# Altium schematic sheet MelansonTech Isolated Shunt Amplifier.SchDoc
size C
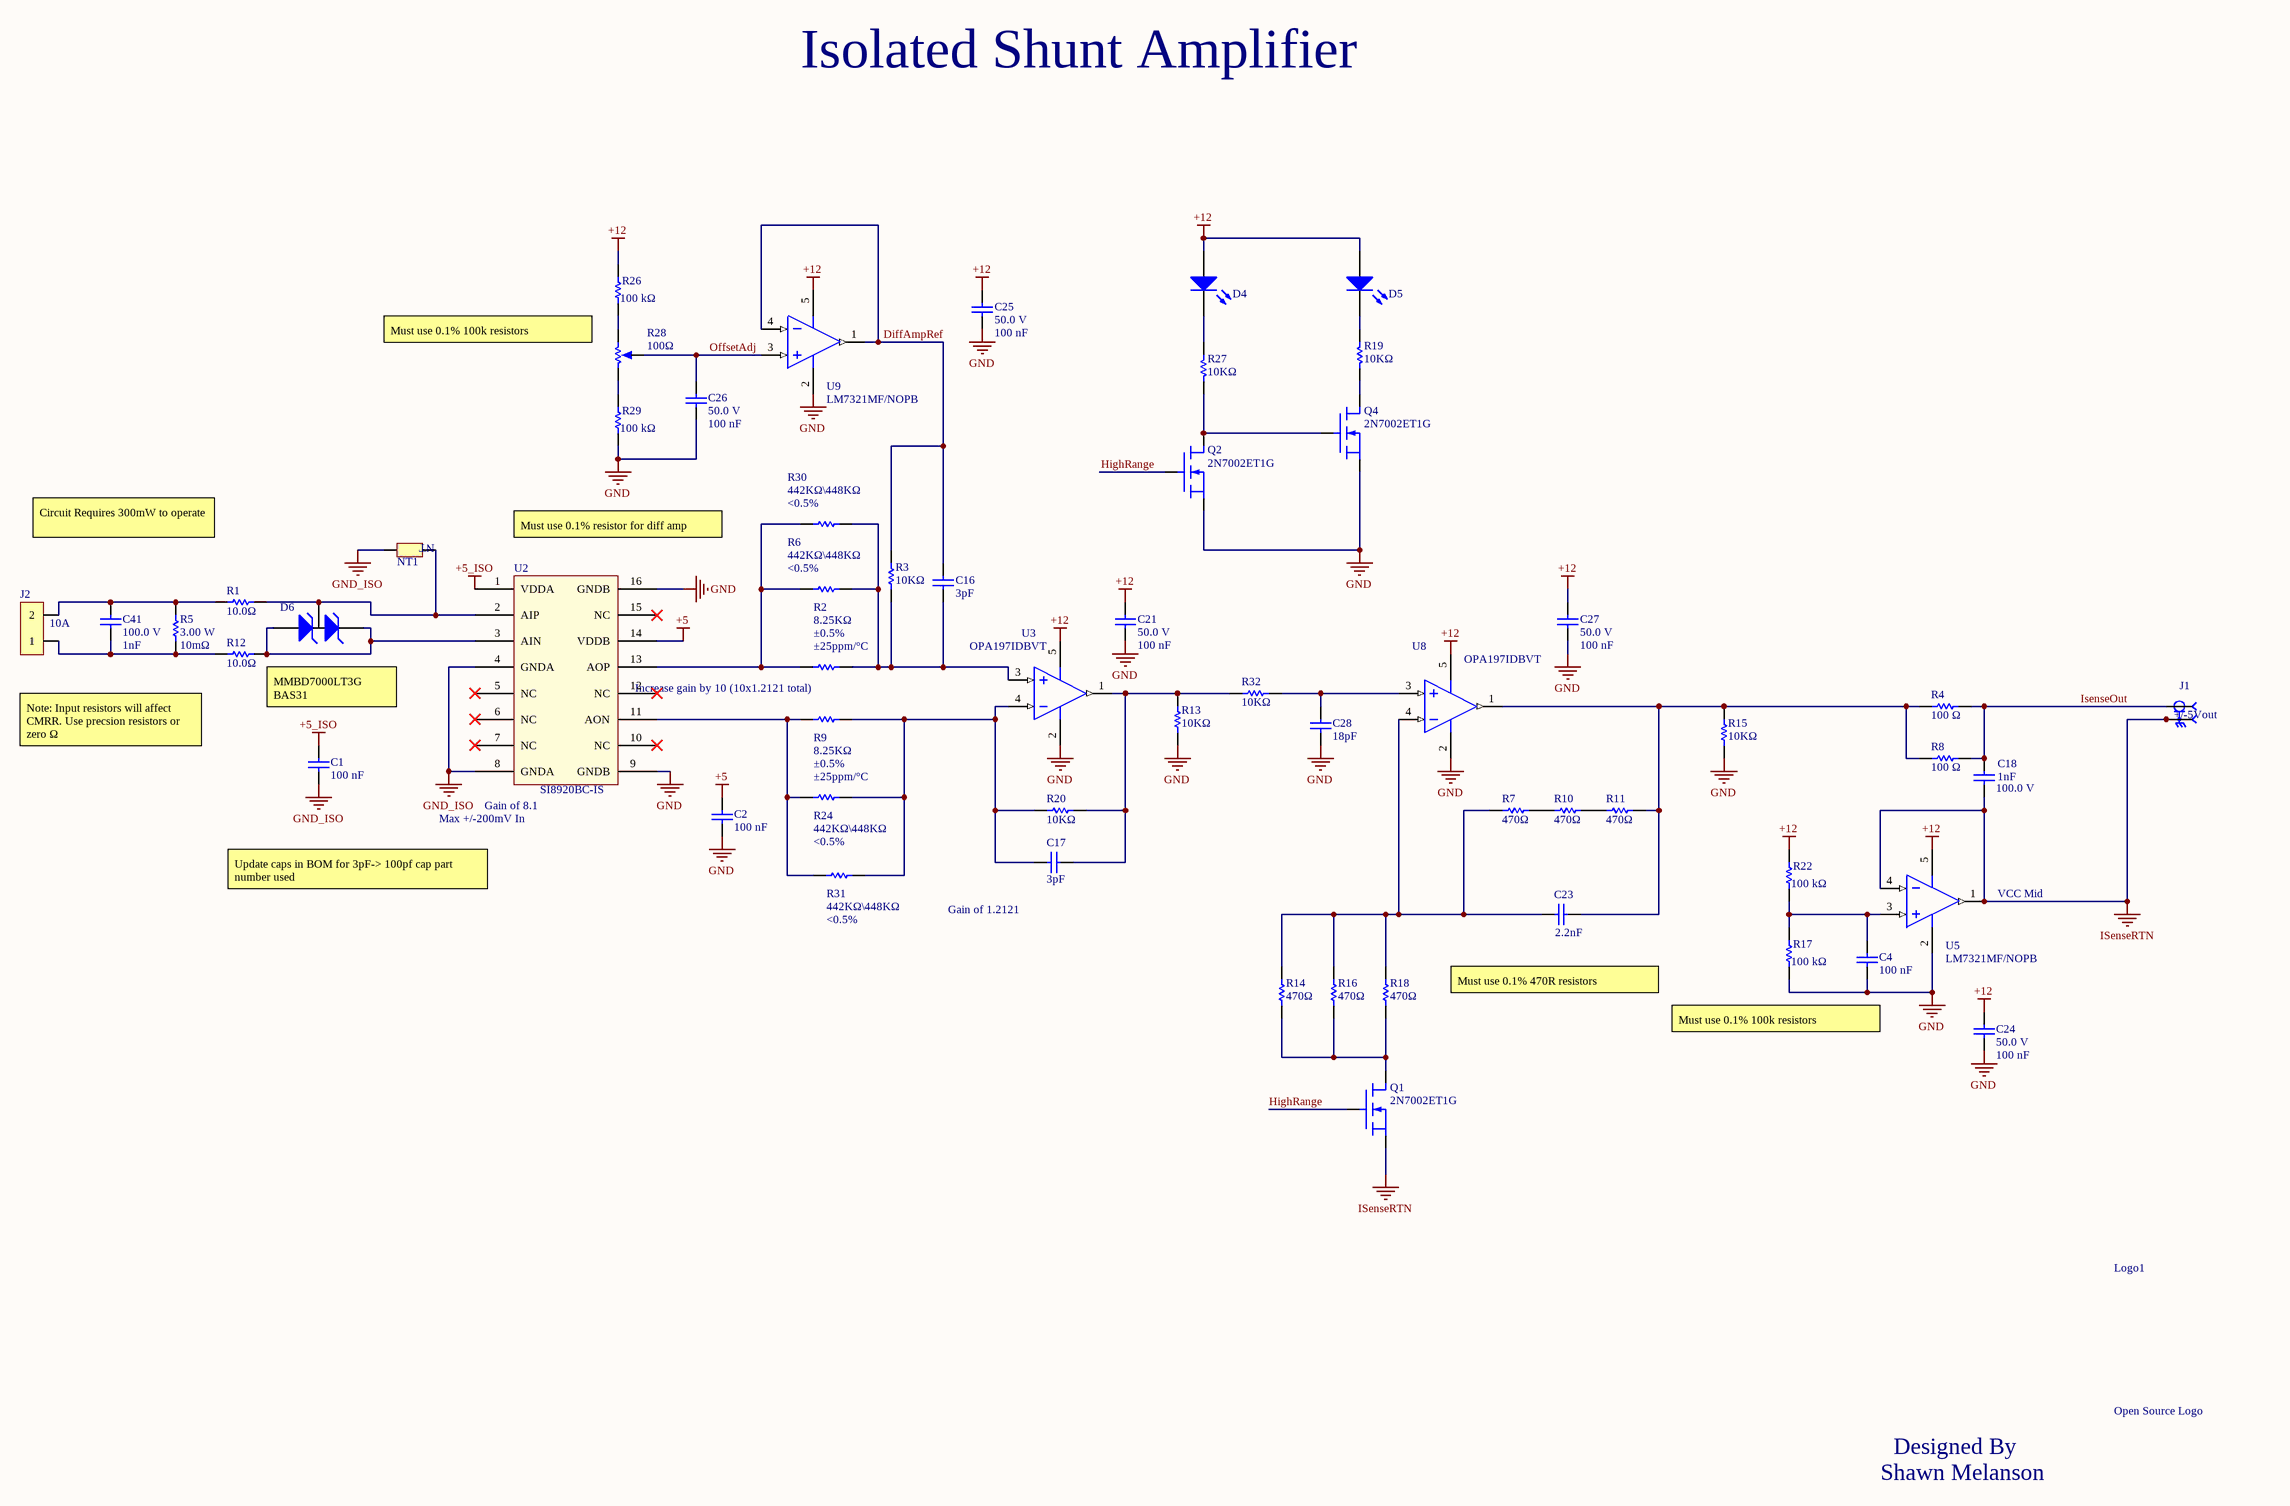
[diagram p0: MelansonTech Isolated Shunt Amplifier.SchDoc]

## Parts
C1  Capacitance: 100 nF  [CAP, 0805, HD]  (hidden comment: 08055C104JAT2A)
C2  Capacitance: 100 nF  [CAP, 0805, HD]  (hidden comment: 08055C104JAT2A)
C4  Capacitance: 100 nF  [CAP, 0805, HD]  (hidden comment: 08055C104JAT2A)
C16  Capacitance: 3pF  [CAP, 0805, HD]  (hidden comment: GRM21A5C2E101JW01D)
C17  Capacitance: 3pF  [CAP, 0805, HD]  (hidden comment: GRM21A5C2E101JW01D)
C18  Voltage Rating (DC): 100.0 V  Capacitance: 1nF  [CAP, 0805, HD]  (hidden comment: C0805X102J1GACAUTO)
C21  Voltage Rating (DC): 50.0 V  Capacitance: 100 nF  [CAP, 0805, HD]  (hidden comment: 08055C104JAT2A)
C23  Cap: 2.2nF  [CAP, 0805, HD]  (hidden comment: Cap)
C24  Voltage Rating (DC): 50.0 V  Capacitance: 100 nF  [CAP, 0805, HD]  (hidden comment: 08055C104JAT2A)
C25  Voltage Rating (DC): 50.0 V  Capacitance: 100 nF  [CAP, 0805, HD]  (hidden comment: 08055C104JAT2A)
C26  Voltage Rating (DC): 50.0 V  Capacitance: 100 nF  [CAP, 0805, HD]  (hidden comment: 08055C104JAT2A)
C27  Voltage Rating (DC): 50.0 V  Capacitance: 100 nF  [CAP, 0805, HD]  (hidden comment: 08055C104JAT2A)
C28  Capacitance: 18pF  [CAP, 0805, HD]  (hidden comment: GRM21A5C2E101JW01D)
C41  Voltage Rating (DC): 100.0 V  Capacitance: 1nF  [CAP, 0805, HD]  (hidden comment: C0805X102J1GACAUTO)
D4  OVLBB4C7  [LED,TH,T1,3MM-Vert]  (value not drawn)
D5  OVLBB4C7  [LED,TH,T1,3MM-Vert]  (value not drawn)
D6  BAT54SLT1G  [SOT23-3]  (value not drawn)
J1  142-0701-801  [CINCH_142-0701-801]  (value not drawn)
J2  TE Connectivity 282836-2  [TERM BLOCK 2POS SIDE ENTRY 5MM]  (value not drawn)
Logo1  Open Source Logo  [Symbol,Open Source - No Text]
NT1  Net Tie,0.254mm  [0.254mm Net Tie]  (value not drawn)  (net tie, no BOM)
Q1  2N7002ET1G  [SOT23-3]
Q2  2N7002ET1G  [SOT23-3]
Q4  2N7002ET1G  [SOT23-3]
R1  Resistance: 10.0Ω  [res, 0805, HD]  (hidden comment: Vishay CRCW08051K00JNEA)
R2  Tolerance: ±0.5%  Temperature Coefficient: ±25ppm/°C  Resistance: 8.25KΩ  [res, 0805, HD]  (hidden comment: RR1220P-8251-D-M)
R3  Resistance: 10KΩ  [res, 0805, HD]  (hidden comment: Vishay / Dale CRCW080510K0FKTA)
R4  Resistance: 100 Ω  [res, 0805, HD]  (hidden comment: CRCW0805100RJNEAC)
R5  Power Rating: 3.00 W  Resistance: 10mΩ  [Res 2512]  (hidden comment: Res1)
R6  Resistance: 442KΩ\448KΩ  Tolerance: <0.5%  [res, 0805, HD]
R7  Resistance: 470Ω  [res, 0805, HD]  (hidden comment: CR0805-JW-471ELF)
R8  Resistance: 100 Ω  [res, 0805, HD]  (hidden comment: CRCW0805100RJNEAC)
R9  Tolerance: ±0.5%  Temperature Coefficient: ±25ppm/°C  Resistance: 8.25KΩ  [res, 0805, HD]  (hidden comment: RR1220P-8251-D-M)
R10  Resistance: 470Ω  [res, 0805, HD]  (hidden comment: CR0805-JW-471ELF)
R11  Resistance: 470Ω  [res, 0805, HD]  (hidden comment: CR0805-JW-471ELF)
R12  Resistance: 10.0Ω  [res, 0805, HD]  (hidden comment: Vishay / Dale CRCW080510K0FKTA)
R13  Resistance: 10KΩ  [res, 0805, HD]  (hidden comment: Vishay / Dale CRCW080510K0FKTA)
R14  Resistance: 470Ω  [res, 0805, HD]  (hidden comment: CR0805-JW-471ELF)
R15  Resistance: 10KΩ  [res, 0805, HD]  (hidden comment: Vishay / Dale CRCW080510K0FKTA)
R16  Resistance: 470Ω  [res, 0805, HD]  (hidden comment: CR0805-JW-471ELF)
R17  Resistance: 100 kΩ  [res, 0805, HD]  (hidden comment: CRCW0805100KFKEA)
R18  Resistance: 470Ω  [res, 0805, HD]  (hidden comment: CR0805-JW-471ELF)
R19  Resistance: 10KΩ  [res, 0805, HD]  (hidden comment: Vishay / Dale CRCW080510K0FKTA)
R20  Resistance: 10KΩ  [res, 0805, HD]  (hidden comment: Vishay / Dale CRCW080510K0FKTA)
R22  Resistance: 100 kΩ  [res, 0805, HD]  (hidden comment: CRCW0805100KFKEA)
R24  Resistance: 442KΩ\448KΩ  Tolerance: <0.5%  [res, 0805, HD]
R26  Resistance: 100 kΩ  [res, 0805, HD]  (hidden comment: CRCW0805100KFKEA)
R27  Resistance: 10KΩ  [res, 0805, HD]  (hidden comment: Vishay / Dale CRCW080510K0FKTA)
R28  Resistance: 100Ω  [Res,SMD,POT,TC33 Series]  (hidden comment: TC33X-2-101E)
R29  Resistance: 100 kΩ  [res, 0805, HD]  (hidden comment: CRCW0805100KFKEA)
R30  Resistance: 442KΩ\448KΩ  Tolerance: <0.5%  [res, 0805, HD]
R31  Resistance: 442KΩ\448KΩ  Tolerance: <0.5%  [res, 0805, HD]
R32  Resistance: 10KΩ  [res, 0805, HD]  (hidden comment: Vishay / Dale CRCW080510K0FKTA)
U2  SI8920BC-IS  [SOIC-16 - Wide]
U3  OPA197IDBVT  [SOT23-5]
U5  LM7321MF/NOPB  [SOT23-5]
U8  OPA197IDBVT  [SOT23-5]
U9  LM7321MF/NOPB  [SOT23-5]

## Nets
+5: C2.2 U2.14(VDDB)
+5_ISO: C1.2 U2.1(VDDA)
+12: C21.2 C24.2 C25.2 C27.2 D4.1(A) D5.1(A) R22.2 R26.2 U3.5(V+) U5.5(V+) U8.5(V+) U9.5(V+)
GND: C2.1 C4.1 C21.1 C24.1 C25.1 C26.1 C27.1 C28.2 Q2.2(S) Q4.2(S) R13.2 R15.1 R17.1 R29.1 U2.9(GNDB) U2.16(GNDB) U3.2(V-) U5.2(V-) U8.2(V-) U9.2(V-)
GND_ISO: C1.1 NT1.2 U2.4(GNDA) U2.8(GNDA)
ISenseRTN: C18.1 J1.S1 J1.S2 J1.S3 J1.S4 Q1.2(S) U5.1(OUT) U5.4(IN-)
DiffAmpRef: C16.1 R3.1 U9.1(OUT) U9.4(IN-)
HighRange: Q1.1(G) Q2.1(G)
IsenseOut: C18.2 J1.1 R4.1 R8.1
OffsetAdj: C26.2 R28.2 U9.3(IN+)
NetC4_2: C4.2 R17.2 R22.1 U5.3(IN+)
NetC16_2: C16.2 R2.1 R3.2 R6.1 R30.1 U3.3(1IN+)
NetC17_1: C17.1 R13.1 R20.1 R32.1 U3.1(1OUT)
NetC17_2: C17.2 R9.1 R20.2 R24.1 R31.1 U3.4(1IN-)
NetC23_1: C23.1 R4.2 R8.2 R11.1 R15.2 U8.1(1OUT)
NetC23_2: C23.2 R7.2 R14.1 R16.1 R18.1 U8.4(1IN-)
NetC28_1: C28.1 R32.2 U8.3(1IN+)
NetC41_1: C41.1 J2.1 R5.2 R12.2
NetC41_2: C41.2 J2.2 R1.2 R5.1
NetD4_2: D4.2(K) R27.1
NetD5_2: D5.2(K) R19.1
NetD6_1: D6.1(A) D6.2(K) R12.1 U2.3(AIN)
NetD6_3: D6.3(AK) NT1.1 R1.1 U2.2(AIP)
NetQ1_3: Q1.3(D) R14.2 R16.2 R18.2
NetQ2_3: Q2.3(D) Q4.1(G) R27.2
NetQ4_3: Q4.3(D) R19.2
NetR2_2: R2.2 R6.2 R30.2 U2.13(AOP)
NetR7_1: R7.1 R10.2
NetR9_2: R9.2 R24.2 R31.2 U2.11(AON)
NetR10_1: R10.1 R11.2
NetR26_1: R26.1 R28.3
NetR28_1: R28.1 R29.2

Not connected (* = marked no-connect by the designer): U2 5(NC)* 6(NC)* 7(NC)* 10(NC)* 12(NC)* 15(NC)*

## Notes on the sheet
- Isolated Shunt Amplifier
- Must use 0.1% 100k resistors
- Circuit Requires 300mW to operate
- Must use 0.1% resistor for diff amp
- 10A
- (near R12) MMBD7000LT3G
  BAS31
- (near U3) Increase gain by 10 (10x1.2121 total)
- (near J1) +/-5Vout
- Note: Input resistors will affect CMRR. Use precsion resistors or zero Ω
- (near U2) Max +/-200mV In
- (near U2) Gain of 8.1
- Update caps in BOM for 3pF-> 100pf cap part number used
- (near C17) Gain of 1.2121
- (near U5) VCC Mid
- Must use 0.1% 470R resistors
- Shawn Melanson
- Designed By
- (in symbol Net Tie,0.254mm) NT

## Library data of the parts
C1 C2 C4 = Cap,0805,100nf,50V,5%,08055C104JAT2A: Capacitor; Ceramic; Cap 0.1 uF; Tol 5%; Vol-Rtg 50 VDC; SMT; 0805; X7R; Tape & Reel; Lead-Free Status: Lead Free; Voltage Rating (DC): 50.0 V; Case/Package (SI): 2012; Insulation Resistance: 100 GΩ; Detailed Description: 0.1µF ±5% 50V Ceramic Capacitor X7R 0805 (2012 Metric); Mounting Style: Surface Mount; Packaging: Tape & Reel (TR), Cut Tape (CT); RoHS: Compliant; Size-Width: 1.24 mm; Case/Package: 0805; Number of Pins: 2; digikey url: http://www.digikey.ca/product-detail/en/avx-corporation/08055C104JAT2A/478-3352-1-ND/930144; REACH SVHC Compliance: No SVHC; Dielectric Characteristic: X7R; Capacitance Tolerance: ±5%; Size-Length: 2.01 mm; Size-Height: 710 µm; Size-Thickness: 940 µm; Manufacturer Part Number: 08055C104JAT2A; Octopart URL: http://octopart.com/08055c104jat2a-avx-55388010; Operating Temperature: -55°C ~ 125°C
C16 C17 C23 C28 = CAP,0805,Generic
C18 C41 = Cap,0805,1nF,±5%,100Vdc,CL10F104ZB8NNNC: CAPACITOR, 1NF, 100V, NP0, 0805; Capacitance Tolerance: ±5%; Dielectric Characteristic: C0G/NP0; Dielectric Material: Ceramic; Lead-Free Status: Lead Free; Case/Package: 0805; Mounting Style: Surface Mount; Octopart Url: https://octopart.com/c0805x102j1gacauto-kemet-23280135; Packaging: Cut Tape (CT); REACH SVHC Compliance: No SVHC; RoHS: Compliant; mfg P/N: C0805X102J1GACAUTO; Supplier 1: Digi-Key; Supplier Part Number 1: 399-19430-1-ND
C21 C24-C27 = Cap,0805,100nf,50V,5%,08055C104JAT2A: Capacitor; Ceramic; Cap 0.1 uF; Tol 5%; Vol-Rtg 50 VDC; SMT; 0805; X7R; Tape & Reel; Lead-Free Status: Lead Free; Case/Package (SI): 2012; Insulation Resistance: 100 GΩ; Detailed Description: 0.1µF ±5% 50V Ceramic Capacitor X7R 0805 (2012 Metric); Mounting Style: Surface Mount; Packaging: Tape & Reel (TR), Cut Tape (CT); RoHS: Compliant; Size-Width: 1.24 mm; Case/Package: 0805; Number of Pins: 2; digikey url: http://www.digikey.ca/product-detail/en/avx-corporation/08055C104JAT2A/478-3352-1-ND/930144; REACH SVHC Compliance: No SVHC; Dielectric Characteristic: X7R; Capacitance Tolerance: ±5%; Size-Length: 2.01 mm; Size-Height: 710 µm; Size-Thickness: 940 µm; Manufacturer Part Number: 08055C104JAT2A; Octopart URL: http://octopart.com/08055c104jat2a-avx-55388010; Operating Temperature: -55°C ~ 125°C; Supplier 1: Digi-Key; Supplier Part Number 1: 478-3352-1-ND
D4 D5 = LED,TH,T1,3mm,Blue,OVLBB4C7: Blue 470nm LED Indication - Discrete 3.2V Radial; Mfg: TT Electronics/Optek Technology; Product Status: Active; Configuration: Standard; Lens Color: Colorless; Lens Transparency: Clear; Millicandela Rating: 1800mcd; Lens Style: Round with Domed Top; Lens Size: 3mm, T-1; Current - Test: 20mA; Viewing Angle: 45°; Base Product Number: OVLBB4; Category: Optoelectronics  LED Indication - Discrete; Color: Blue; Voltage - Forward (Vf) (Typ): 3.2V; Mounting Type: Through Hole; Wavelength - Dominant: 470nm; Package / Case: Radial; Supplier Device Package: 3mm; Height (Max): 5.35mm
D6 = Diode,Shottky,Array,Series,30V,200mA,BAT54SLT1G: Diode Array 1 Pair Series Connection Schottky 30V 200mA (DC) Surface Mount TO-236-3, SC-59, SOT-23-3; Manufacturer: ON Semiconductor; Voltage - Forward (Vf) (Max) @ If: 800mV @ 100mA; Speed: Small Signal =< 200mA (Io), Any Speed; Reverse Recovery Time (trr): 5ns; Current - Reverse Leakage @ Vr: 2µA @ 25V; Detailed Description: Diode Array 1 Pair Series Connection Schottky 30V 200mA (DC) Surface Mount TO-236-3, SC-59, SOT-23-3; mfg P/N: BAT54SLT1G; Diode Type: Schottky; Diode Configuration: 1 Pair Series Connection; Voltage - DC Reverse (Vr) (Max): 30V; Current - Average Rectified (Io) (per Diode): 200mA (DC); Operating Temperature - Junction: 125°C (Max); Mounting Type: Surface Mount; Package / Case: TO-236-3, SC-59, SOT-23-3; Supplier Device Package: SOT-23-3 (TO-236); Base Part Number: BAT54SL; Supplier 1: Digi-Key; Supplier Part Number 1: BAT54SLT1GOSCT-ND; Supplier 2: LCSC; Supplier Part Number 2: C19726
J1 = Conn,SMA,Female,End Launch,142-0701-801: CONN SMA JACK STR 50OHM EDGE MNT; Manufacturer: Cinch Connectivity Solutions Johnson; Detailed Description: SMA Connector Jack, Female Socket 50Ohm Board Edge, End Launch Solder; Connector: Style   SMA; Connector Type: Jack, Female Socket; Contact Termination: Solder; Body Material: Brass; Body Finish: Gold; Dielectric Material: Polytetrafluoroethylene (PTFE); Center Contact Material: Beryllium Copper; Mating Cycles: 500; Number of Ports: 1; Frequency - Max: 18GHz; Voltage Rating: 335V; mfg P/N: 142-0701-801; Category: Connectors, Interconnects  Coaxial Connectors (RF); Part Status: Active; Shield Termination: Solder; Impedance: 50Ohm; Mounting Type: Board Edge, End Launch; Fastening Type: Threaded; Housing Color: Gold; Center Contact Plating: Gold; Operating Temperature: -65°C ~ 165°C; Supplier 1: Digi-Key; Supplier Part Number 1: J502-ND
J2 = TERM BLOCK 2POS SIDE ENTRY 5MM, 282836-2: Wire to Board 2 Position 5 mm Pitch 30-16 AWG Euro Style Terminal Block; Voltage Rating (AC): 250.0 V; ELV Compliant: Compliant; Current Rating: 13.5 A; Number of Contacts: 2; Pin Pitch: 0.005 m; Lead-Free Status: Lead Free; Wire Gauge: 15.0 AWG; RoHS: Compliant; Contact Material: Brass; Contact Plating: Tin; Color: Green; Manufacturer Part Number: 282836-2; Flammability Rating: UL 94 V-0; Mounting Style: PCB; Housing Material: Nylon 6/6; Insulation Material: Nylon; Housing Color: Green; Orientation: Right Angle; Lifecycle Status: Active; REACH SVHC Compliance: No SVHC; Number of Positions: 2; Supplier 1: TME; Supplier 2: Newark; Supplier 3: Digi-Key; Supplier 4: Digi-Key; Supplier Part Number 4: A98076-ND
Logo1 = Symbol,Open Source: Open Source Silk Screen Logo
Q1 Q2 Q4 = MOSFET,N-Channel,SOT23,0.25A,60V,2N7002ET1G: Small Signal MOSFET, 60 V, 310 mA, Single, N-Channel, 3-Pin SOT-23, Pb-Free, Tape and Reel; Manufacturer: ON Semiconductor; Continuous Drain Current (Ids): 0.25A; Lead-Free Status: Lead Free; Drain to Source Voltage (Vds): 60.0 V; Power Dissipation (Max): 350mW (Ta); REACH SVHC Compliance: No SVHC; Number of Pins: 3; Halogen Free Status: Halogen Free; Case/Package: SOT-23-3; Polarity: N-Channel; RoHS: Compliant; Lifecycle Status: Active; Supplier 1: Digi-Key; Supplier Part Number 1: 2N7002ET1GOSCT-ND; Supplier 2: LCSC; Supplier Part Number 2: C71533; Manufacturer Part Number: 2N7002ET1G
R1 R12 = Res,0805,10.0Ω,5%,±200ppm/°C,RMCF0805JT10R0: RES 10 OHM 5% 1/8W 0805; Manufacturer: Stackpole Electronics Inc; Detailed Description: 10 Ohms ±5% 0.125W, 1/8W Chip Resistor 0805 (2012 Metric) Automotive AEC-Q200 Thick Film; Categories: Resistors   Chip Resistor - Surface Mount; Power (Watts): 0.125W, 1/8W; mfg P/N: RMCF0805JT10R0; Part Status: Active; Series: RMCF; Tolerance: ±5%; Composition: Thick Film; Features: Automotive AEC-Q200; Temperature Coefficient: ±200ppm/°C; Operating Temperature: -55°C ~ 155°C; Package / Case: 0805 (2012 Metric); Ratings: AEC-Q200; Supplier Device Package: 0805; Supplier 1: Digi-Key; Supplier Part Number 1: RMCF0805JT10R0CT-ND
R2 R9 = Res,0805,8.25KΩ,0.5%,±25ppm/°C,RR1220P-8251-D-M: RES SMD 8.25KOHM 0.5% 1/10W 0805; Manufacturer: Susumu; Detailed Description: 8.25 kOhms ±0.5% 0.1W, 1/10W Chip Resistor 0805 (2012 Metric) Thin Film; Power (Watts): 0.1W, 1/10W; mfg P/N: RR1220P-8251-D-M; Category: Resistors  Chip Resistor - Surface Mount; Mfr: Susumu; Series: RR; Part Status: Active; Composition: Thin Film; Operating Temperature: -55°C ~ 125°C; Package / Case: 0805 (2012 Metric); Size / Dimension: 0.079"" L x 0.049"" W (2.00mm x 1.25mm); Height - Seated (Max): 0.020"" (0.50mm); Number of Terminations: 2
R3 R13 R15 R19 R20 R27 R32 = Res,0805,10.0kΩ,1%,100 ppm,CRCW080510K0FKTA: RES SMD 10K OHM 1% 1/8W 0805; Temperature Coefficient: 100.0 ppm/C; Lead-Free Status: Contains Lead; Voltage Rating (DC): 150.0 V; Power Rating: 0.125 W; Case/Package (SI): 2012; Size-Width: 0.00125 m; Resistance Tolerance: 1%; Size-Length: 0.002 m; RoHS: Non-Compliant; Power Dissipation: 0.125 W; Number of Pins: 2; REACH SVHC Compliance: No SVHC; Size-Height: 0.00045 m; Case/Package: 0805; Mounting Style: Surface Mount; Supplier 1: Digi-Key; Supplier Part Number 1: 541-3016-1-ND
R4 R8 = Res,0805,100Ω,5%,±200ppm/°C: RES 100 OHM 5% 1/8W 0805; Lead-Free Status: Lead Free; Power Rating: 0.125 W; Detailed Description: 100 Ohms ±5% 0.125W, 1/8W Chip Resistor 0805 (2012 Metric) Thick Film; Case/Package: 0805 (2012 Metric); Number of Pins: 2; RoHS: Compliant; mfg P/N: CRCW0805100RJNEAC; Tolerance: ±5%; Temperature Coefficient: ±200ppm/°C; Operating Temperature: -55°C ~ 155°C; Supplier 1: Digi-Key; Supplier Part Number 1: 541-100ACT-ND
R5 = Res,2512,10mΩ,3.00W,±1%,CRA2512-FZ-R010ELF: Resistor; Metal Film; Res 0.01 Ohms; Pwr-Rtg 3 W; Tol 1%; SMT; 2512; Current Sense; Case/Package (SI): 2512; Resistance Tolerance: ±1%; Octopart URL: http://octopart.com/cra2512-fz-r010elf-bourns-7483589; Manufacturer Part Number: CRA2512-FZ-R010ELF; Packaging: Tape & Reel (TR), Cut Tape (CT); REACH SVHC Compliance: No SVHC; RoHS: Compliant; Number of Pins: 2; Mounting Style: Surface Mount; Case/Package: 1005
R6 R24 R30 R31 = Res,0805,Generic: PPM: *; Wattage: *
R7 R10 R11 R14 R16 R18 = res,0805,470Ω,5%,200ppm,CR0805-JW-471ELF: RES SMD 470 OHM 5% 1/8W 0805; Manufacturer: Bourns Inc.; Detailed Description: 470 Ohms ±5% 0.125W, 1/8W Chip Resistor 0805 (2012 Metric) Moisture Resistant Thick Film; Categories: Resistors   Chip Resistor - Surface Mount; Power (Watts): 0.125W, 1/8W; Temperature Coefficient: ±200ppm/°C; mfg P/N: CR0805-JW-471ELF; Part Status: Active; Tolerance: ±5%; Composition: Thick Film; Features: Moisture Resistant; Operating Temperature: -55°C ~ 155°C; Package / Case: 0805 (2012 Metric); Supplier Device Package: 0805; Size / Dimension: 0.079" L x 0.049" W (2.00mm x 1.25mm); Height - Seated (Max): 0.024" (0.60mm); Number of Terminations: 2; Base Part Number: CR0805; Supplier 1: Digi-Key; Supplier Part Number 1: 118-CR0805-JW-471ELFCT-ND
R17 R22 R26 R29 = Res,0805,100kΩ,1%,100ppm,CRCW0805100KFKEA: 100 kOhms ±1% 0.125W, 1/8W Chip Resistor 0805 (2012 Metric) Thick Film; Manufacturer: Vishay; Lead-Free Status: Lead Free; Case/Package (SI): 2012; Power Rating: 125 mW; Temperature Coefficient: -100 ppm/°C to 100 ppm/°C; Resistance Tolerance: ±1%; RoHS: Compliant; Manufacturer Part Number: CRCW0805100KFKEA; Number of Pins: 2; Size-Length: 2.00 mm; Packaging: Tape & Reel (TR), Reel, Cut Tape (CT); Size-Height: 450 µm; Case/Package: 0805; Size-Width: 1.25 mm; Operating Temperature: 150 °C (max); Supplier 1 Part Number: 679-0803; Supplier 1: RS; Supplier 2: Digi-Key; Supplier Part Number 2: 541-100KCCT-ND
R28 = Res,POT,SMD,100Ω,0.1W, TC33X-2-101E: TRIMMER 100 OHM 0.1W J LEAD TOP; Manufacturer: Bourns Inc.; Detailed Description: 100 Ohms 0.1W, 1/10W J Lead Surface Mount Trimmer Potentiometer Cermet 1 Turn Top Adjustment; Power (Watts): 0.1W, 1/10W; Tolerance: ±25%; Temperature Coefficient: ±250ppm/°C; Adjustment Type: Top Adjustment; Resistive Material: Cermet; Number of Turns: 1; mfg P/N: TC33X-2-101E; Datasheets: TC33 Series; Category: Potentiometers, Variable Resistors  Trimmer Potentiometers; Series: Trimpot® TC33 - Open Frame; Part Status: Active; Mounting Type: Surface Mount; Termination Style: J Lead; Size / Dimension: Rectangular - 0.150"" x 0.142"" Face x 0.047"" H (3.80mm x 3.60mm x 1.20mm); Supplier 1: Digi-Key; Supplier 2: Digi-Key; Supplier Part Number 2: TC33X-101EDKR-ND
U2 = IC,CurrentSense,Isolated,8.1Gain,950Khz, SI8920BC-IS: Isolation IC Inverters, Power Supplies, UPS 16-SOIC; Mfr: Skyworks Solutions Inc.; Detailed Description: Isolation IC Automotive, Inverters, Power Supplies, UPS 8-DIP Gull Wing; Base Product Number: SI8920; Category: Integrated Circuits (ICs)  Linear - Amplifiers - Special Purpose; Part Status: Active; Type: Isolation; Applications: Automotive, Inverters, Power Supplies, UPS; Mounting Type: Surface Mount; Package / Case: 16-SOIC (0.295", 7.50mm Width); Supplier Device Package: 16-SOIC; Mfg P/N: SI8920BC-IS
U3 U8 = OPAMP, single, General Purpose,Rail-to-Rail,10MHz,SOT-23-5,OPA197IDBVT: General Purpose Amplifier 1 Circuit Rail-to-Rail SOT-23-5; Manufacturer: Texas Instruments; Supply Current: 1mA; Number of Channels: 1; Slew Rate: 20V/μs; Gain Bandwidth Product: 10MHz; Voltage - Input Offset: 25uV; Current - Output / Channel: 65mA; Current - Input Bias: 5pA; Voltage - Supply, Single/Dual (±): 4.5 V ~ 36 V, ±2.25 V ~ 18 V; REACH SVHC Compliance: No SVHC; Operating Temperature: -40°C ~ 125°C; Supplier Device Package: SOT-23-5; Supplier 1: LCSC; Supplier Part Number 1: C131929; Supplier 2: Digi-Key; Supplier Part Number 2: 296-44076-6-ND; Mfg P/N: OPA197IDBVT
U5 U9 = OPAMP,20Mhz,MOSFET DRIVER,SOT23-5,LM7321MF: Single Rail-to-Rail Input/Output, ±15V, High Output Current and Unlimited Capacitive Load Operational Amplifier, 5-pin SOT-23, Pb-Free; Bandwidth: 20000000.0 Hz; Input Offset Drift: 2e-06 V/K; Lead-Free Status: Lead Free; Number of Channels: 1; Output Current: 0.06 A; Slew Rate: 18.0 V/μs; Case/Package: SOIC; Gain Bandwidth Product: 20000000.0 Hz; Lifecycle Status: Active; Mounting Style: Surface Mount; Number of Pins: 5; Packaging: Tape & Reel (TR); REACH SVHC Compliance: No SVHC; RoHS: Compliant; mfg P/N: LM7321MF/NOPB; Supplier 1: Digi-Key; Supplier Part Number 1: LM7321MF/NOPBCT-ND; Supplier 2: LCSC; Supplier Part Number 2: C128614